# EAGLE schematic apollo_sensor_v4 (EAGLE 9.3.0)

## Sheet 1 of 2
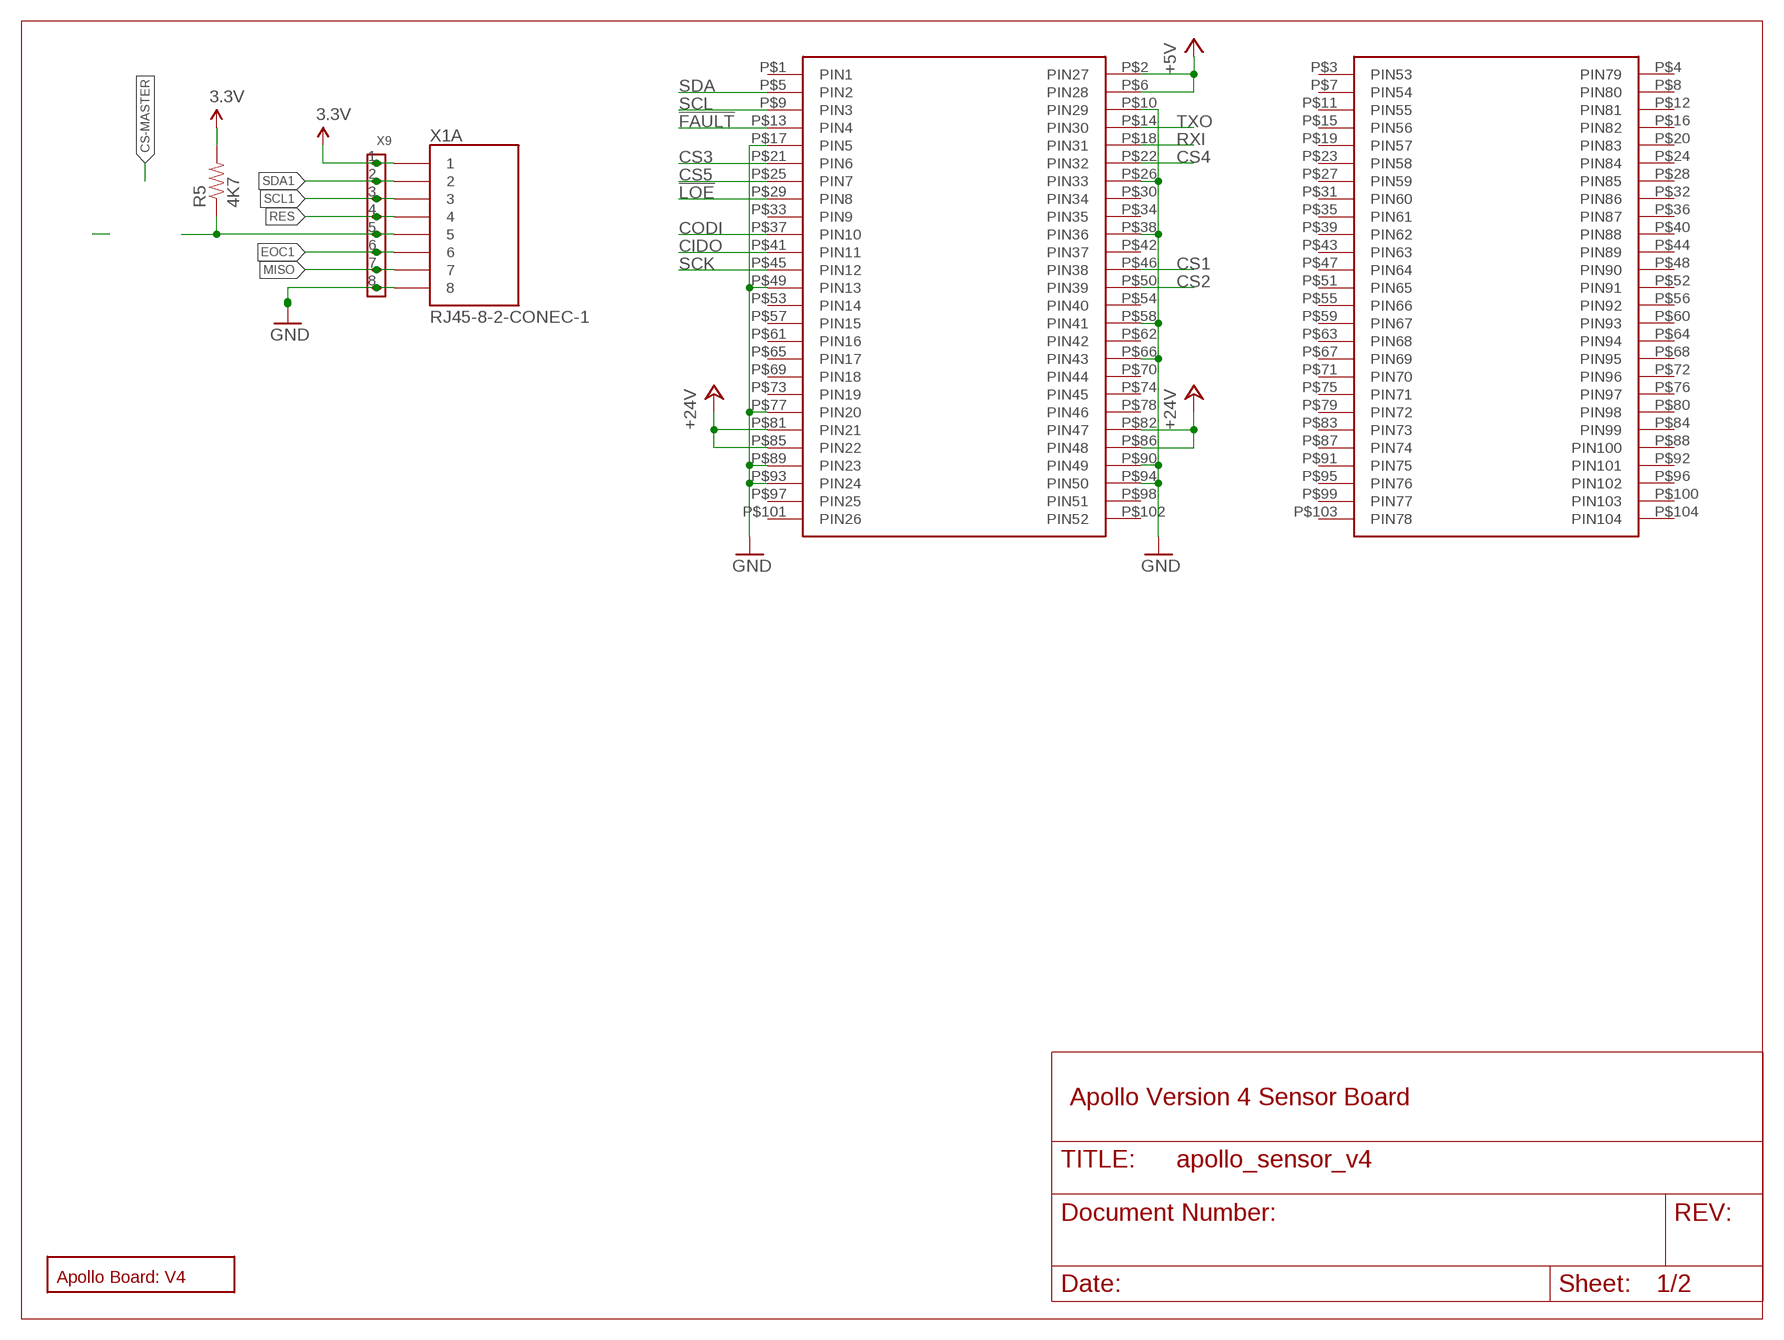
[diagram p0: schematic, sheet 1]

### Parts
R5  4K7  RESISTOR0805-RES  [0805]
U$1  PC104_CONNECTOR  [PC104_CONNECTOR]
U$2  BOARD_TEMPLATE1  [BOARD_TEMPLATE]
X1  RJ45-8-2-CONEC-1  [CONEC-33TS3004ST-88001]
X9  TP-GROUP-X8-2X04  [2X4]

### Nets
3.3V: R5.2 X1.1 X9.1
!FAULT!: U$1.P$13(PIN4)
!LOE!: U$1.P$29(PIN8)
+5V: U$1.P$2(PIN27) U$1.P$6(PIN28)
+24V: U$1.P$81(PIN21) U$1.P$82(PIN47) U$1.P$85(PIN22) U$1.P$86(PIN48)
CIDO: U$1.P$41(PIN11)
CODI: U$1.P$37(PIN10)
CS1: U$1.P$46(PIN38)
CS2: U$1.P$50(PIN39)
CS3: U$1.P$21(PIN6)
CS4: U$1.P$22(PIN32)
CS5: U$1.P$25(PIN7)
EOC1: X1.6 X9.6
GND: U$1.P$10(PIN29) U$1.P$17(PIN5) U$1.P$26(PIN33) U$1.P$38(PIN36) U$1.P$49(PIN13) U$1.P$58(PIN41) U$1.P$66(PIN43) U$1.P$77(PIN20) U$1.P$89(PIN23) U$1.P$90(PIN49) U$1.P$93(PIN24) U$1.P$94(PIN50) X1.8 X1.M1 X1.M2 X9.8
MISO: X1.7 X9.7
N$9: R5.1 X1.5 X9.5
RES: X1.4 X9.4
RXI: U$1.P$18(PIN31)
SCK: U$1.P$45(PIN12)
SCL: U$1.P$9(PIN3)
SCL1: X1.3 X9.3
SDA: U$1.P$5(PIN2)
SDA1: X1.2 X9.2
TXO: U$1.P$14(PIN30)
Unconnected: U$1.P$1(PIN1) U$1.P$3(PIN53) U$1.P$4(PIN79) U$1.P$7(PIN54) U$1.P$8(PIN80) U$1.P$11(PIN55) U$1.P$12(PIN81) U$1.P$15(PIN56) U$1.P$16(PIN82) U$1.P$19(PIN57) U$1.P$20(PIN83) U$1.P$23(PIN58) U$1.P$24(PIN84) U$1.P$27(PIN59) U$1.P$28(PIN85) U$1.P$30(PIN34) U$1.P$31(PIN60) U$1.P$32(PIN86) U$1.P$33(PIN9) U$1.P$34(PIN35) U$1.P$35(PIN61) U$1.P$36(PIN87) U$1.P$39(PIN62) U$1.P$40(PIN88) U$1.P$42(PIN37) U$1.P$43(PIN63) U$1.P$44(PIN89) U$1.P$47(PIN64) U$1.P$48(PIN90) U$1.P$51(PIN65) U$1.P$52(PIN91) U$1.P$53(PIN14) U$1.P$54(PIN40) U$1.P$55(PIN66) U$1.P$56(PIN92) U$1.P$57(PIN15) U$1.P$59(PIN67) U$1.P$60(PIN93) U$1.P$61(PIN16) U$1.P$62(PIN42) U$1.P$63(PIN68) U$1.P$64(PIN94) U$1.P$65(PIN17) U$1.P$67(PIN69) U$1.P$68(PIN95) U$1.P$69(PIN18) U$1.P$70(PIN44) U$1.P$71(PIN70) U$1.P$72(PIN96) U$1.P$73(PIN19) U$1.P$74(PIN45) U$1.P$75(PIN71) U$1.P$76(PIN97) U$1.P$78(PIN46) U$1.P$79(PIN72) U$1.P$80(PIN98) U$1.P$83(PIN73) U$1.P$84(PIN99) U$1.P$87(PIN74) U$1.P$88(PIN100) U$1.P$91(PIN75) U$1.P$92(PIN101) U$1.P$95(PIN76) U$1.P$96(PIN102) U$1.P$97(PIN25) U$1.P$98(PIN51) U$1.P$99(PIN77) U$1.P$100(PIN103) U$1.P$101(PIN26) U$1.P$102(PIN52) U$1.P$103(PIN78) U$1.P$104(PIN104)

### Notes on the sheet
- Apollo Version 4 Sensor Board

## Sheet 2 of 2

## Library data of the parts
R5 = apollo-ctrl:RESISTOR: Resistor Basic schematic elements and footprints for 0603, 1206, and PTH resistors.
U$1 = template_board:PC104_CONNECTOR
U$2 = template_board:BOARD_TEMPLATE
X1 = apollo-ctrl:RJ45-8-2
X9 = apollo-ctrl:TP-GROUP-X8